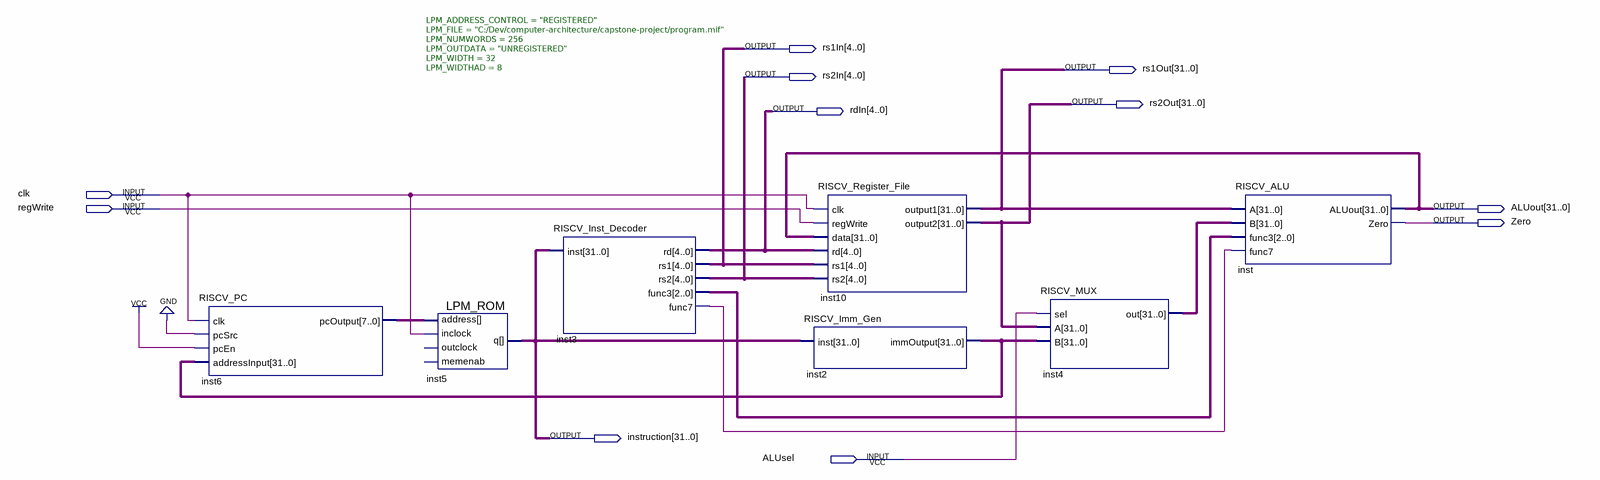
[diagram p0: schematic sheet]
// Quartus schematic CPU.bdf as structural Verilog: 7 symbols, 11 pins
module CPU (
  input  clk,
  input  regWrite,
  input  ALUsel,
  output [4:0] rs1In,
  output [31:0] rs1Out,
  output [4:0] rs2In,
  output [31:0] rs2Out,
  output [4:0] rdIn,
  output [31:0] ALUout,
  output Zero,
  output [31:0] instruction
);

  wire inst3_func7;
  wire [2:0] inst3_func3;
  wire [7:0] inst6_pcoutput;
  wire [31:0] inst2_immoutput, inst4_out;

  RISCV_PC inst6 (.clk(clk), .pcSrc(1'b0), .pcEn(1'b1), .addressInput(inst2_immoutput), .pcOutput(inst6_pcoutput));
  LPM_ROM #(.LPM_ADDRESS_CONTROL("REGISTERED"), .LPM_FILE("C:/Dev/computer-architecture/capstone-project/program.mif"), .LPM_NUMWORDS(256), .LPM_OUTDATA("UNREGISTERED"), .LPM_WIDTH(32), .LPM_WIDTHAD(8)) inst5 (
    .address(inst6_pcoutput), .inclock(clk), .q(instruction));  // open: outclock, memenab
  RISCV_Inst_Decoder inst3 (
    .inst(instruction), .rd(rdIn), .rs1(rs1In), .rs2(rs2In), .func3(inst3_func3), .func7(inst3_func7));
  RISCV_Register_File inst10 (
    .clk(clk), .regWrite(regWrite), .data(ALUout), .rd(rdIn), .rs1(rs1In), .rs2(rs2In), .output1(rs1Out),
    .output2(rs2Out));
  RISCV_Imm_Gen inst2 (.inst(instruction), .immOutput(inst2_immoutput));
  RISCV_MUX inst4 (.sel(ALUsel), .A(rs2Out), .B(inst2_immoutput), .out(inst4_out));
  RISCV_ALU inst (.A(rs1Out), .B(inst4_out), .func3(inst3_func3), .func7(inst3_func7), .ALUout(ALUout), .Zero(Zero));
endmodule
